# EAGLE design sunface (EAGLE 9.4.2)
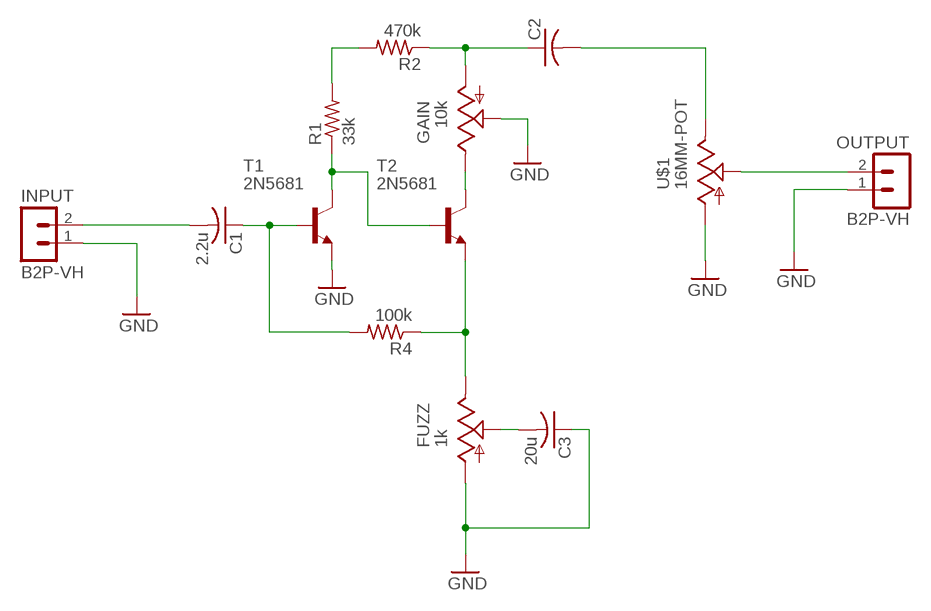
[diagram p0: schematic, sheet 1]

## Parts
C1  2.2u  C-US050-045X075  [C050-045X075]
C2  C-US050-045X075  [C050-045X075]
C3  20u  C-US050-045X075  [C050-045X075]
FUZZ  1k  16MM-POT  [ALPHA-16-MINI]
GAIN  10k  16MM-POT  [ALPHA-16-MINI]
INPUT  B2P-VH  [B2P-VH]
OUTPUT  B2P-VH  [B2P-VH]
R1  33k  R-US_0411/15  [0411/15]
R2  470k  R-US_0411/15  [0411/15]
R4  100k  R-US_0411/15  [0411/15]
T1  2N5681  [TO5]
T2  2N5681  [TO5]
U$1  16MM-POT  [ALPHA-16-MINI]

## Nets
GND: C3.1 FUZZ.LEFT GAIN.WIPER INPUT.1 OUTPUT.1 T1.1(E) U$1.LEFT
N$1: R1.1 T1.3(C) T2.2(B)
N$2: C1.1 R4.2 T1.2(B)
N$3: R1.2 R2.2
N$4: C2.1 GAIN.LEFT R2.1
N$5: GAIN.RIGHT T2.3(C)
N$6: FUZZ.RIGHT R4.1 T2.1(E)
N$7: C2.2 U$1.RIGHT
N$8: OUTPUT.2 U$1.WIPER
N$9: C1.2 INPUT.2
N$11: C3.2 FUZZ.WIPER

## Library data of the parts
C1-C3 = rcl:C-US: CAPACITOR, American symbol; SPICEPREFIX: C
FUZZ GAIN U$1 = pedalPartsLibrary:16MM-POT
INPUT OUTPUT = con-JST VH:B2P-VH: JST VH Series header 3.96mm pitch disconnectable crimp style connectors, vertical (side entry type), 2 pins
R1 R2 R4 = rcl:R-US_: RESISTOR, American symbol; SPICEPREFIX: R
T1 T2 = transistor:2N5681: NPN TRANSISTOR

## Board
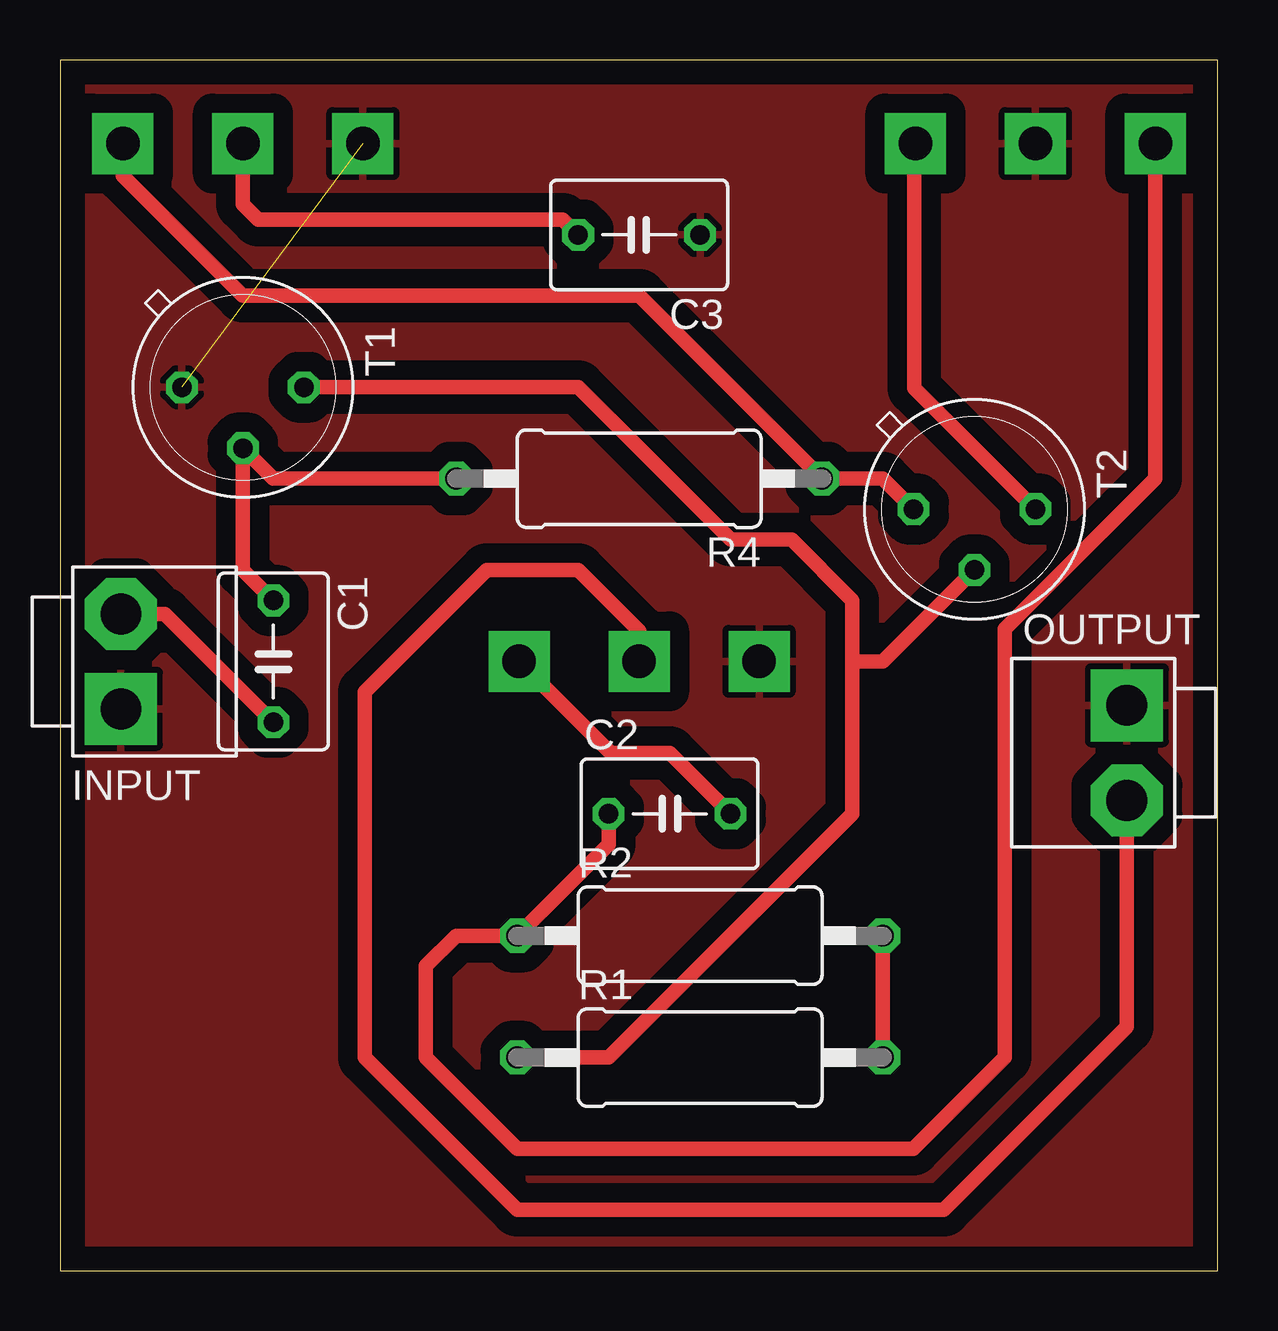
[diagram p1: board, top side]

Size 48.24 x 50.47 mm. Coordinates in mm from the lower left corner, seen from the top.
Outline: 0,0 48.24,0 48.24,50.47 0,50.47 0,0
Copper layers (1*16): Top 0.035mm / dielectric 1.5mm / Bottom 0.035mm
Design rules "default": minimum track width 6mil, minimum drill 0.35mm, track to track 6mil, track to pad 6mil, pad to pad 6mil, via to via 6mil, smd to smd 6mil, copper to edge 40mil, drill to drill 6mil, minimum pad ring 10mil, minimum via ring 8mil, stop-mask expansion 4mil, vias tented up to drill 0mil, thermal gap 10mil

### Footprints (pad centres in the part's own frame; a part is rotated, then mirrored left to right if it is on the bottom)
C050-045X075 = drill 0.813 octagon: 1 -2.54,0; 2 2.54,0
ALPHA-16-MINI = drill 1.4 pad 2.54 square: LEFT -5,0; RIGHT 5,0; WIPER 0,0
B2P-VH = drill 1.7 pad 3 square: 1 -1.98,0 | drill 1.7 pad 3 octagon: 2 1.98,0
0411/15 = drill 0.914 octagon: 1 -7.62,0; 2 7.62,0
TO5 = drill 0.813 octagon: 1 0,-2.54; 2 2.54,0; 3 0,2.54

### Placement (x,y rotation side)
C1  8.89,25.4 270 top
C2  25.4,19.05 0 top
C3  24.13,43.18 180 top
FUZZ  7.62,46.99 0 bottom
GAIN  40.64,46.99 0 bottom
INPUT  2.54,25.4 90 top
OUTPUT  44.45,21.59 270 top
R1  26.67,8.89 0 top
R2  26.67,13.97 0 top
R4  24.13,33.02 180 top
T1  7.62,36.83 270 top
T2  38.1,31.75 270 top
U$1  24.13,25.4 0 bottom

### Tracks (layer width: path | path; a pad name or v marks a point on that pad's centre or on a via)
GND  (1 unrouted)
  pour Top (isolate 0.813): -1.27,52.07 49.53,52.07 49.53,-1.27 -1.27,-1.27
N$1
  Top 0.61: T1.3 21.59,36.83 27.94,30.48 30.48,30.48 33.02,27.94 33.02,25.4 | R1.1 22.86,8.89 33.02,19.05 33.02,25.4 | 33.02,25.4 34.29,25.4 T2.2
N$2
  Top 0.61: C1.1 7.62,29.21 T1.2 8.89,33.02 R4.2
N$3
  Top 0.61: R1.2 R2.2
N$4
  Top 0.61: C2.1 22.86,17.78 R2.1 16.51,13.97 15.24,12.7 15.24,8.89 19.05,5.08 35.56,5.08 39.37,8.89 39.37,26.75 45.64,33.02 GAIN.LEFT
N$5
  Top 0.61: 35.56,46.91 35.6,46.95 | 35.6,46.95 GAIN.RIGHT | T2.3 35.6,36.79 35.6,46.95
N$6
  Top 0.61: 2.54,46.91 FUZZ.RIGHT 2.62,45.64 7.62,40.64 24.13,40.64 R4.1 34.29,33.02 T2.1
N$7
  Top 0.61: U$1.RIGHT 22.94,21.59 25.4,21.59 C2.2
N$8
  Top 0.61: U$1.WIPER 24.13,26.67 21.59,29.21 17.78,29.21 12.7,24.13 12.7,8.89 19.05,2.54 36.83,2.54 44.45,10.16 OUTPUT.2
N$9
  Top 0.61: INPUT.2 4.37,27.38 C1.2
N$11
  Top 0.61: FUZZ.WIPER 7.62,44.45 8.26,43.81 20.95,43.81 C3.2